# Altium schematic sheet MCU.SchDoc
size A4; SheetNumber: 1; SheetTotal: 4
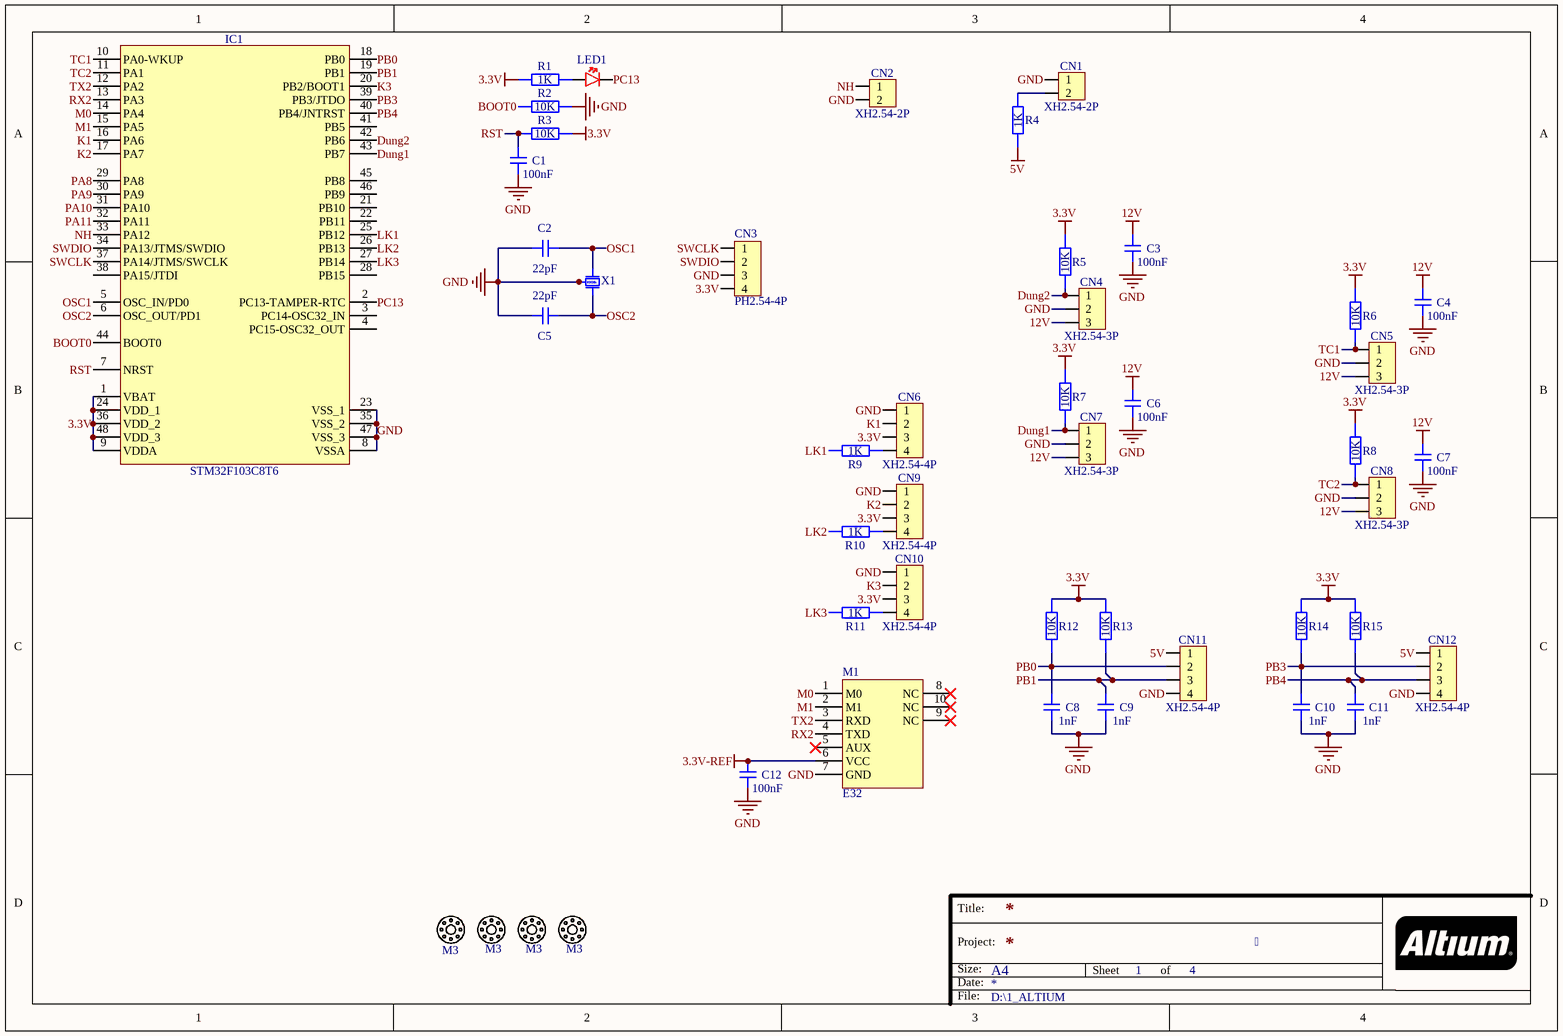
[diagram p0: MCU.SchDoc]

## Parts
1  M3  [Screw hole M3]
2  M3  [Screw hole M3]
3  M3  [Screw hole M3]
4  M3  [Screw hole M3]
C1  100nF  [CAP-0603-2]
C2  22pF  [CAP-0603-2]
C3  100nF  [CAP-0603-2]
C4  100nF  [CAP-0603-2]
C5  22pF  [CAP-0603-2]
C6  100nF  [CAP-0603-2]
C7  100nF  [CAP-0603-2]
C8  1nF  [CAP-0603-2]
C9  1nF  [CAP-0603-2]
C10  1nF  [CAP-0603-2]
C11  1nF  [CAP-0603-2]
C12  100nF  [CAP-0603-2]
CN1  XH2.54-2P  [Plugin,P=2.54mm,2P]
CN2  XH2.54-2P  [Plugin,P=2.54mm,2P]
CN3  PH2.54-4P  [Plugin,P=2.54mm,4P,Pin Headers]
CN4  XH2.54-3P  [Plugin,P=2.54mm,3P]
CN5  XH2.54-3P  [Plugin,P=2.54mm,3P]
CN6  XH2.54-4P  [Plugin,P=2.54mm,4P]
CN7  XH2.54-3P  [Plugin,P=2.54mm,3P]
CN8  XH2.54-3P  [Plugin,P=2.54mm,3P]
CN9  XH2.54-4P  [Plugin,P=2.54mm,4P]
CN10  XH2.54-4P  [Plugin,P=2.54mm,4P]
CN11  XH2.54-4P  [Plugin,P=2.54mm,4P]
CN12  XH2.54-4P  [Plugin,P=2.54mm,4P]
IC1  STM32F103C8T6  [LQFP-48(7x7)]
LED1  RED  [LED-0603]  (value not drawn)
M1  E32  [E32-TTL-100]
R1  1K  [RES-0603-1]
R2  10K  [RES-0603-1]
R3  10K  [RES-0603-1]
R4  1K  [RES-0603-1]
R5  10K  [RES-0603-1]
R6  10K  [RES-0603-1]
R7  10K  [RES-0603-1]
R8  10K  [RES-0603-1]
R9  1K  [RES-0603-1]
R10  1K  [RES-0603-1]
R11  1K  [RES-0603-1]
R12  10K  [RES-0603-1]
R13  10K  [RES-0603-1]
R14  10K  [RES-0603-1]
R15  10K  [RES-0603-1]
X1  8MHz  [SMD5032-4P]  (value not drawn)

## Nets
3.3V: CN3.4 CN6.3 CN9.3 CN10.3 IC1.1(VBAT) IC1.9(VDDA) IC1.24(VDD_1) IC1.36(VDD_2) IC1.48(VDD_3) R1.1 R3.2 R5.2 R6.2 R7.2 R8.2 R12.2 R13.2 R14.2 R15.2
3.3V-REF: C12.1 M1.6(VCC)
5V: CN11.1 CN12.1 R4.1
12V: C3.1 C4.1 C6.1 C7.1 CN4.3 CN5.3 CN7.3 CN8.3
GND: C1.2 C2.2 C3.2 C4.2 C5.2 C6.2 C7.2 C8.2 C9.2 C10.2 C11.2 C12.2 CN1.1 CN2.2 CN3.3 CN4.2 CN5.2 CN6.1 CN7.2 CN8.2 CN9.1 CN10.1 CN11.4 CN12.4 IC1.8(VSSA) IC1.23(VSS_1) IC1.35(VSS_2) IC1.47(VSS_3) M1.7(GND) R2.2 X1.2(GND) X1.4(GND)
BOOT0: IC1.44(BOOT0) R2.1
Dung1: CN7.1 IC1.43(PB7) R7.1
Dung2: CN4.1 IC1.42(PB6) R5.1
K1: CN6.2 IC1.16(PA6)
K2: CN9.2 IC1.17(PA7)
K3: CN10.2 IC1.20(PB2/BOOT1)
LK1: IC1.25(PB12) R9.1
LK2: IC1.26(PB13) R10.1
LK3: IC1.27(PB14) R11.1
M0: IC1.14(PA4) M1.1(M0)
M1: IC1.15(PA5) M1.2(M1)
NH: CN2.1 IC1.33(PA12)
OSC1: C2.1 IC1.5(OSC_IN/PD0) X1.1
OSC2: C5.1 IC1.6(OSC_OUT/PD1) X1.3
PA8: IC1.29(PA8)
PA9: IC1.30(PA9)
PA10: IC1.31(PA10)
PA11: IC1.32(PA11)
PB0: C8.1 CN11.2 IC1.18(PB0) R12.1
PB1: C9.1 CN11.3 IC1.19(PB1) R13.1
PB3: C10.1 CN12.2 IC1.39(PB3/JTDO) R14.1
PB4: C11.1 CN12.3 IC1.40(PB4/JNTRST) R15.1
PC13: IC1.2(PC13-TAMPER-RTC) LED1.2(K)
RST: C1.1 IC1.7(NRST) R3.1
RX2: IC1.13(PA3) M1.4(TXD)
SWCLK: CN3.1 IC1.37(PA14/JTMS/SWCLK)
SWDIO: CN3.2 IC1.34(PA13/JTMS/SWDIO)
TC1: CN5.1 IC1.10(PA0-WKUP) R6.1
TC2: CN8.1 IC1.11(PA1) R8.1
TX2: IC1.12(PA2) M1.3(RXD)
NetCN1_2: CN1.2 R4.2
NetCN6_4: CN6.4 R9.2
NetCN9_4: CN9.4 R10.2
NetCN10_4: CN10.4 R11.2
NetLED1_1: LED1.1(A) R1.2

Not connected (* = marked no-connect by the designer): IC1 3(PC14-OSC32_IN) 4(PC15-OSC32_OUT) 21(PB10) 22(PB11) 28(PB15) 38(PA15/JTDI) 41(PB5) 45(PB8) 46(PB9); M1 5(AUX)* 8(NC)* 9(NC)* 10(NC)*

## Notes on the sheet
- Title:
- Size:
- Date:
- Project:
- A4
- Sheet
- of
- File:
- D:\1_ALTIUM

## Library data of the parts
1-4 = Screw hole M3
C1 C3 C4 C6 C7 C12 = CL10B104KB8NNNC: 100nF ±10% 50V Ceramic Capacitor X7R 0603; Manufacturer: Samsung Electro-Mechanics; Package: 0603; LCSC Part #: C1591; Mfr.Part #: CL10B104KB8NNNC; DigiKey Part Number: 1276-1000-2-ND; ComponentLink1Description: Link; ComponentLink1URL: https://www.lcsc.com/product-detail/C1591.html?s_z=n_CL10B104KB8NNC; ComponentLink2Description: Link 1; ComponentLink2URL: https://www.digikey.com/en/products/detail/samsung-electro-mechanics/CL10B104KB8NNNC/3886658?s=N4IgTCBcDaIMIBkCMAGAQqgLAaTQDgDki4QBdAXyA
C2 C5 = CC0603JRNPO9BN220: 22pF ±5% 50V Ceramic Capacitor NP0 0603; Manufacturer: YAGEO; Package: 0603; LCSC Part #: C105620; Mfr.Part #: CC0603JRNPO9BN220; DigiKey Part Number: 311-1062-2-ND; ComponentLink1Description: Link; ComponentLink1URL: https://www.lcsc.com/product-detail/C105620.html?s_z=n_CC0603JRNPO9BN220; ComponentLink2Description: Link 1; ComponentLink2URL: https://www.digikey.com/en/products/detail/yageo/CC0603JRNPO9BN220/302796?s=N4IgTCBcDaIMJwAwDZEGYBSAlAcgBQHkBOAIRzDERAF0BfIA
C8-C11 = CC0603KRX7R9BB102: 1nF ±10% 50V Ceramic Capacitor X7R 0603; Manufacturer: YAGEO; Package: 0603; LCSC Part #: C100040; Mfr.Part #: CC0603KRX7R9BB102; DigiKey Part Number: 311-1080-2-ND; ComponentLink1Description: Link; ComponentLink1URL: https://www.lcsc.com/product-detail/C100040.html?s_z=n_C100040; ComponentLink2Description: Link 1; ComponentLink2URL: https://www.digikey.com/en/products/detail/yageo/CC0603KRX7R9BB102/302814?s=N4IgTCBcDaIMJwAwDZEGYDSAlAGgdiwE4AhYgRkQgF0BfIA
CN1 CN2 = BX-XH2.54-2PZZ: Connector Header 2 position 2.5mm Pitch 3A Through Hole -25℃~+85℃; Manufacturer: Bossie; Mfr.Part #: BX-XH2.54-2PZZ; LCSC Part #: C18077833; Package: Through Hole,P=2.5mm; DigiKey Part Number: NO; ComponentLink1Description: Link; ComponentLink1URL: https://www.lcsc.com/product-detail/C18077833.html?s_z=n_BX-XH2.54-2PZZ
CN3 = PH2.54-1X4P-H25: Pin Header 4 Position 2.54mm Pitch Single Row Through Hole -40℃~+105℃; Manufacturer: JXTCONN; Mfr.Part #: PH2.54-1X4P-H25; DigiKey Part Number: NO; Package: Plugin,P=2.54mm; LCSC Part #: C42431808
CN4 CN5 CN7 CN8 = BX-XH2.54-3PZZ: Connector Header 3 position 2.5mm Pitch 3A Through Hole -25℃~+85℃; Manufacturer: Bossie; Mfr.Part #: BX-XH2.54-3PZZ; LCSC Part #: C18077834; Package: Through Hole,P=2.5mm; DigiKey Part Number: NO; ComponentLink1Description: Link; ComponentLink1URL: https://www.lcsc.com/product-detail/C18077834.html?s_z=n_BX-XH2.54-3PZZ
CN6 CN9-CN12 = BX-XH2.54-4PZZ: Connector Header 4 position 2.5mm Pitch 3A Through Hole -25℃~+85℃; Manufacturer: Bossie; Mfr.Part #: BX-XH2.54-4PZZ; LCSC Part #: C18077835; Package: Through Hole,P=2.5mm; DigiKey Part Number: NO; ComponentLink1Description: Link; ComponentLink1URL: https://www.lcsc.com/product-detail/C18077835.html?s_z=n_BX-XH2.54-4PZZ
IC1 = STM32F103C8T6: ARM Cortex-M3 32 Bit 72MHz 37 LQFP-48(7x7) Microcontrollers RoHS; Manufacturer: ST; Mfr.Part #: STM32F103C8T6; Package: LQFP-48(7x7); LCSC Part #: C8734; DigiKey Part Number: 497-6063-ND; ComponentLink1Description: Link; ComponentLink1URL: https://www.lcsc.com/product-detail/C8734.html?s_z=n_STM32F103C8T6; ComponentLink2Description: Link 1; ComponentLink2URL: https://www.digikey.com/en/products/detail/stmicroelectronics/STM32F103C8T6/1646338
LED1 = YLED0603R: 25mA 1.8V~2.4V Red 0603 LED Indication - Discrete ROHS; Manufacturer: YONGYUTAI; Mfr.Part #: YLED0603R; Package: 0603; LCSC Part #: C19171390; DigiKey Part Number: NO; ComponentLink1Description: Link; ComponentLink1URL: https://www.lcsc.com/product-detail/C19171390.html?s_z=n_C19171390; ComponentLink2Description: Link 1
M1 = E32-TTL-100: E32-TTL-100 is a 100mW wireless transceiver module with LoRa / spread-spectrum technology, operates at 410~441MHz (Default: 433MHz), based on original imported RFIC SX1278 from SEMTECH; Manufacturer: Chengdu Ebyte Electronic; Mfr.Part #: E32-TTL-100; Package: Through Hole,P=2.54mm; LCSC Part #: NO; DigiKey Part Number: NO; ComponentLink1Description: Link; ComponentLink1URL: https://nshopvn.com/product/module-rf-sx1278-lora-e32/
R1 R4 R9-R11 = RC0603FR-071KL: 100mW 1kΩ 75V Thick Film Resistor ±100ppm/℃ ±1% 0603 Chip Resistor - Surface Mount RoHS; Manufacturer: YAGEO; Mfr.Part #: RC0603FR-071KL; Package: 0603; LCSC Part #: C22548; DigiKey Part Number: 311-1.00KHRTR-ND; ComponentLink1Description: Link; ComponentLink1URL: https://www.lcsc.com/product-detail/C22548.html?s_z=n_C22548; ComponentLink2Description: Link 1; ComponentLink2URL: https://www.digikey.com/en/products/detail/yageo/RC0603FR-071KL/726843?s=N4IgTCBcDaIEoGEAMA2JBmAYnAtEg7AIwDSAMiALoC%2BQA
R2 R3 R5-R8 R12-R15 = RC0603FR-0710KL: 100mW 10kΩ 75V Thick Film Resistor ±100ppm/℃ ±1% 0603 Chip Resistor - Surface Mount RoHS; Manufacturer: YAGEO; Package: 0603; LCSC Part #: C98220; Mfr.Part #: RC0603FR-0710KL; DigiKey Part Number: 311-10.0KHRTR-ND; ComponentLink1Description: Link; ComponentLink1URL: https://www.lcsc.com/product-detail/C98220.html?s_z=n_C98220; ComponentLink2Description: Link 1; ComponentLink2URL: https://www.digikey.com/en/products/detail/yageo/RC0603FR-0710KL/726880?s=N4IgTCBcDaIMwEYEFoEAYB0aDSAJASgCr7IByAIiALoC%2BQA
X1 = X50328MSB4SI: Crystal 8MHz ±10ppm 20pF SMD5032-4P; Manufacturer: YXC Crystal Oscillators; Mfr.Part #: X50328MSB4SI; Package: SMD5032-4P; LCSC Part #: C157341; DigiKey Part Number: NO; ComponentLink1Description: Link; ComponentLink1URL: https://www.lcsc.com/product-detail/C157341.html?s_z=n_c157341; ComponentLink2Description: Link 1